# EAGLE design Raspberry_output_for_DC_slave_multi (EAGLE 5.10)
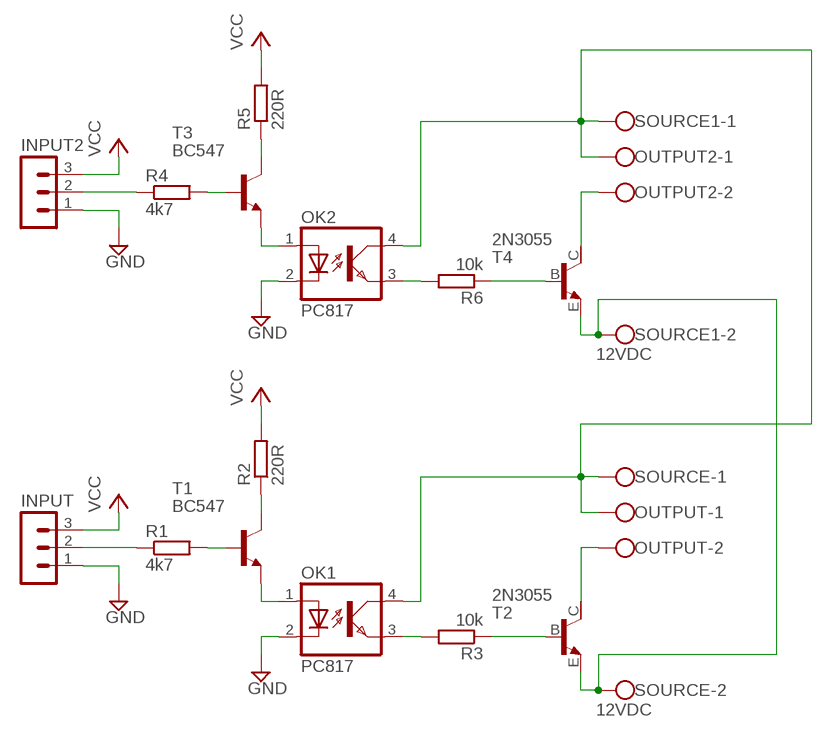
[diagram p0: schematic, sheet 1]

## Parts
INPUT  MA03-1  [MA03-1]
INPUT2  MA03-1  [MA03-1]
OK1  PC817  [DIL04]
OK2  PC817  [DIL04]
OUTPUT  W237-102  [W237-102]
OUTPUT2  W237-102  [W237-102]
R1  4k7  R-EU_0207/10  [0207/10]
R2  220R  R-EU_0207/10  [0207/10]
R3  10k  R-EU_0207/10  [0207/10]
R4  4k7  R-EU_0207/10  [0207/10]
R5  220R  R-EU_0207/10  [0207/10]
R6  10k  R-EU_0207/10  [0207/10]
SOURCE  12VDC  W237-102  [W237-102]
SOURCE1  12VDC  W237-102  [W237-102]
T1  BC547  [TO92]
T2  2N3055  [TO3]
T3  BC547  [TO92]
T4  2N3055  [TO3]

## Nets
GND: INPUT2.1 INPUT.1 OK1.2(C) OK2.2(C)
INPUT: INPUT.2 R1.1
INPUT1: INPUT2.2 R4.1
INPUT_REGULATED_CURR_2_BASE: R1.2 T1.2(B)
INPUT_REGULATED_CURR_2_BASE1: R4.2 T3.2(B)
N$1: R5.1 T3.3(C)
N$2: R2.1 T1.3(C)
OPTO_IN: OK1.1(A) T1.1(E)
OPTO_IN1: OK2.1(A) T3.1(E)
OPTO_OUT_2_TR: OK1.3(EMIT) R3.2
OPTO_OUT_2_TR1: OK2.3(EMIT) R6.2
OUTPUT_N: OUTPUT.2 T2.C
OUTPUT_N1: OUTPUT2.2 T4.C
SOURCE_N_0V: SOURCE1.2 SOURCE.2 T2.E T4.E
SOURCE_P_12V: OK1.4(COL) OK2.4(COL) OUTPUT2.1 OUTPUT.1 SOURCE1.1 SOURCE.1
TR_OUTPUT_BASE: R3.1 T2.B
TR_OUTPUT_BASE1: R6.1 T4.B
VCC: INPUT2.3 INPUT.3 R2.2 R5.2
Unconnected: T2.C/(C) T4.C/(C)

## Library data of the parts
INPUT INPUT2 = con-lstb:MA03-1: PIN HEADER
OK1 OK2 = optocoupler:PC817: SHARP OPTO COUPLER
OUTPUT OUTPUT2 SOURCE SOURCE1 = con-wago-500:W237-102: WAGO SCREW CLAMP
R1-R6 = rcl:R-EU_: RESISTOR, European symbol
T1 T3 = transistor-neu-to92:BC547: NPN TRANSISTOR
T2 T4 = transistor:2N3055: NPN TRANSISTOR

## Board
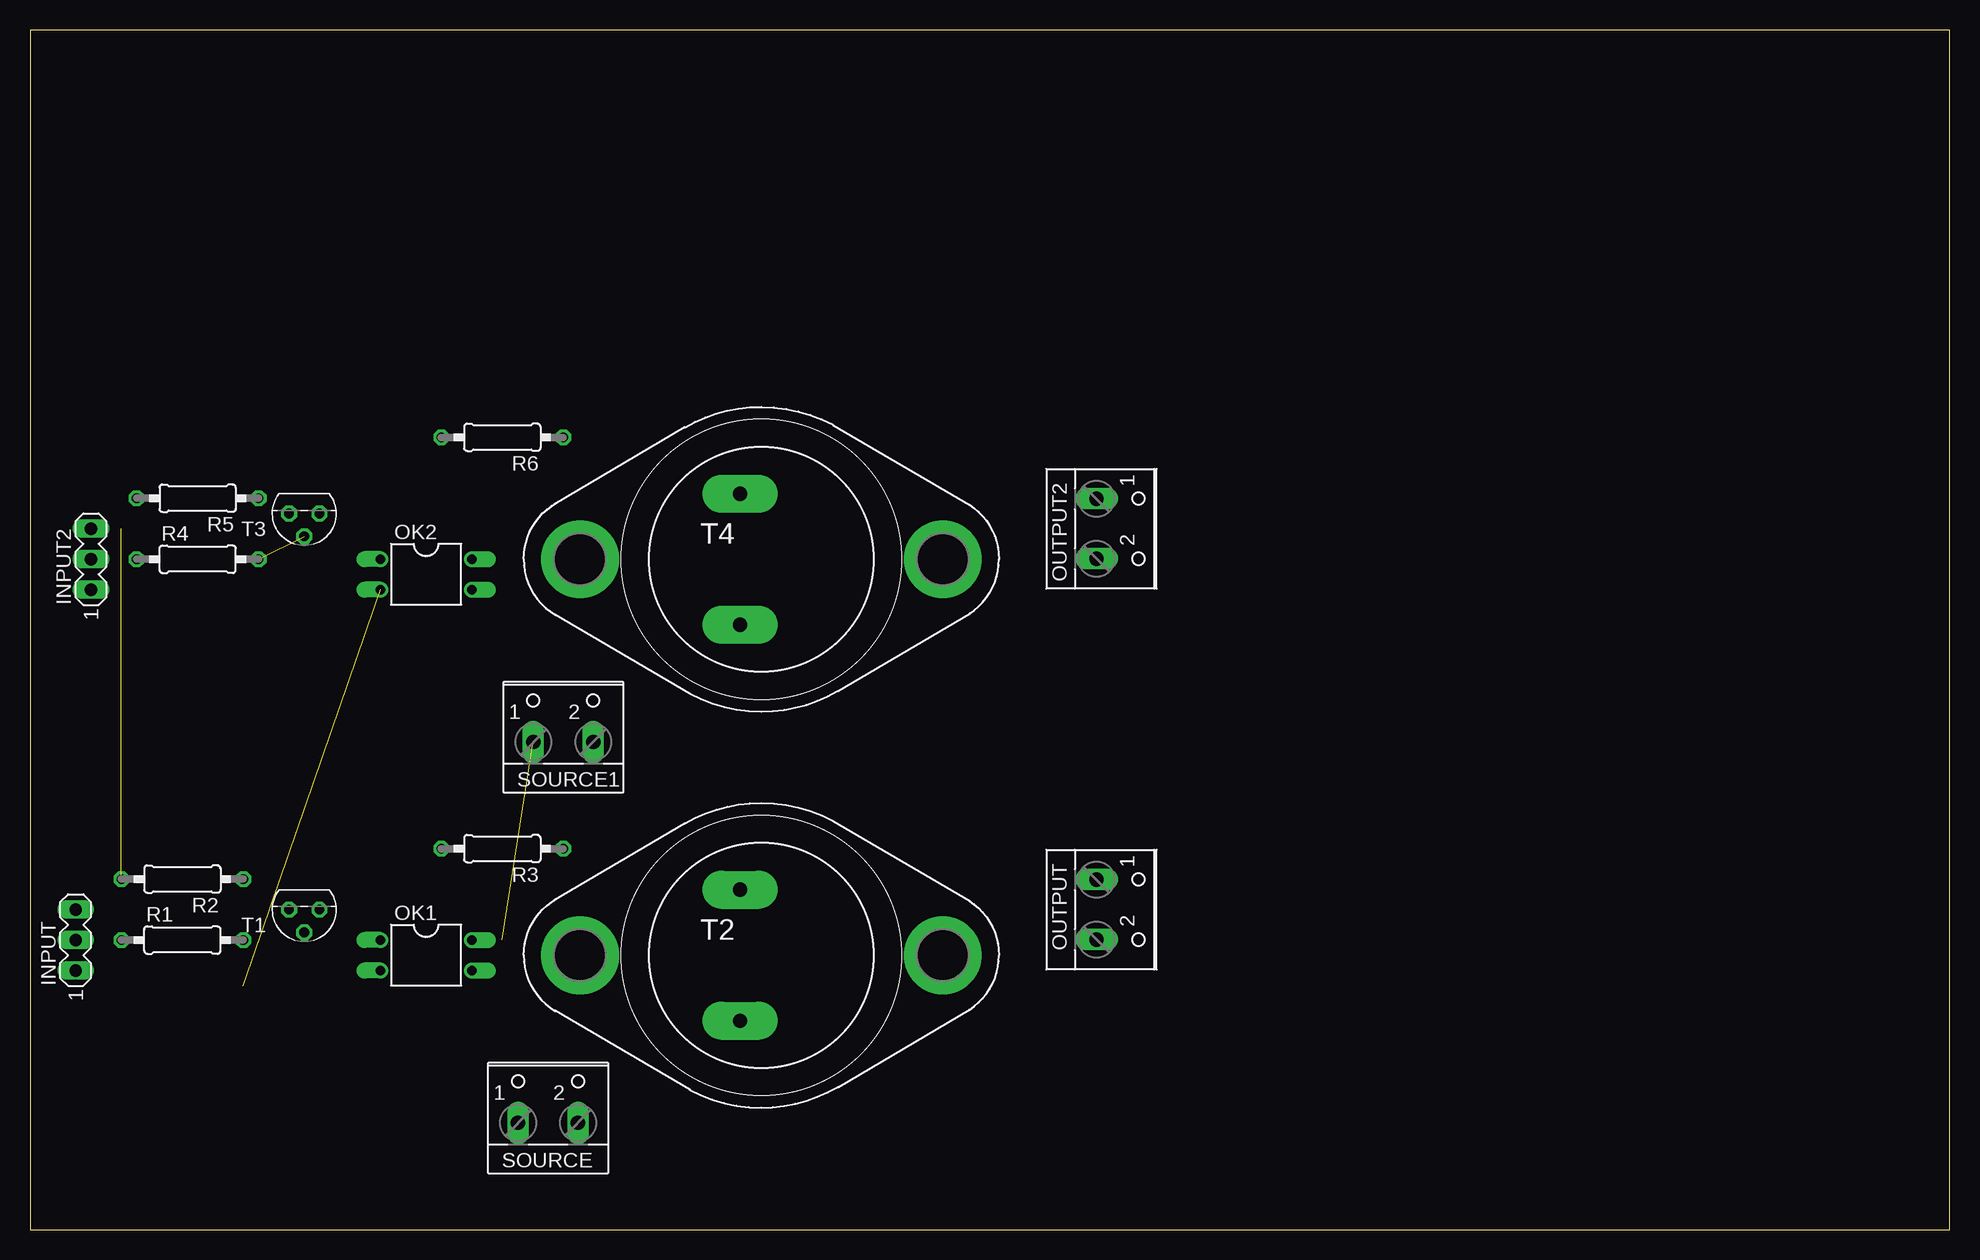
[diagram p1: board, top side]
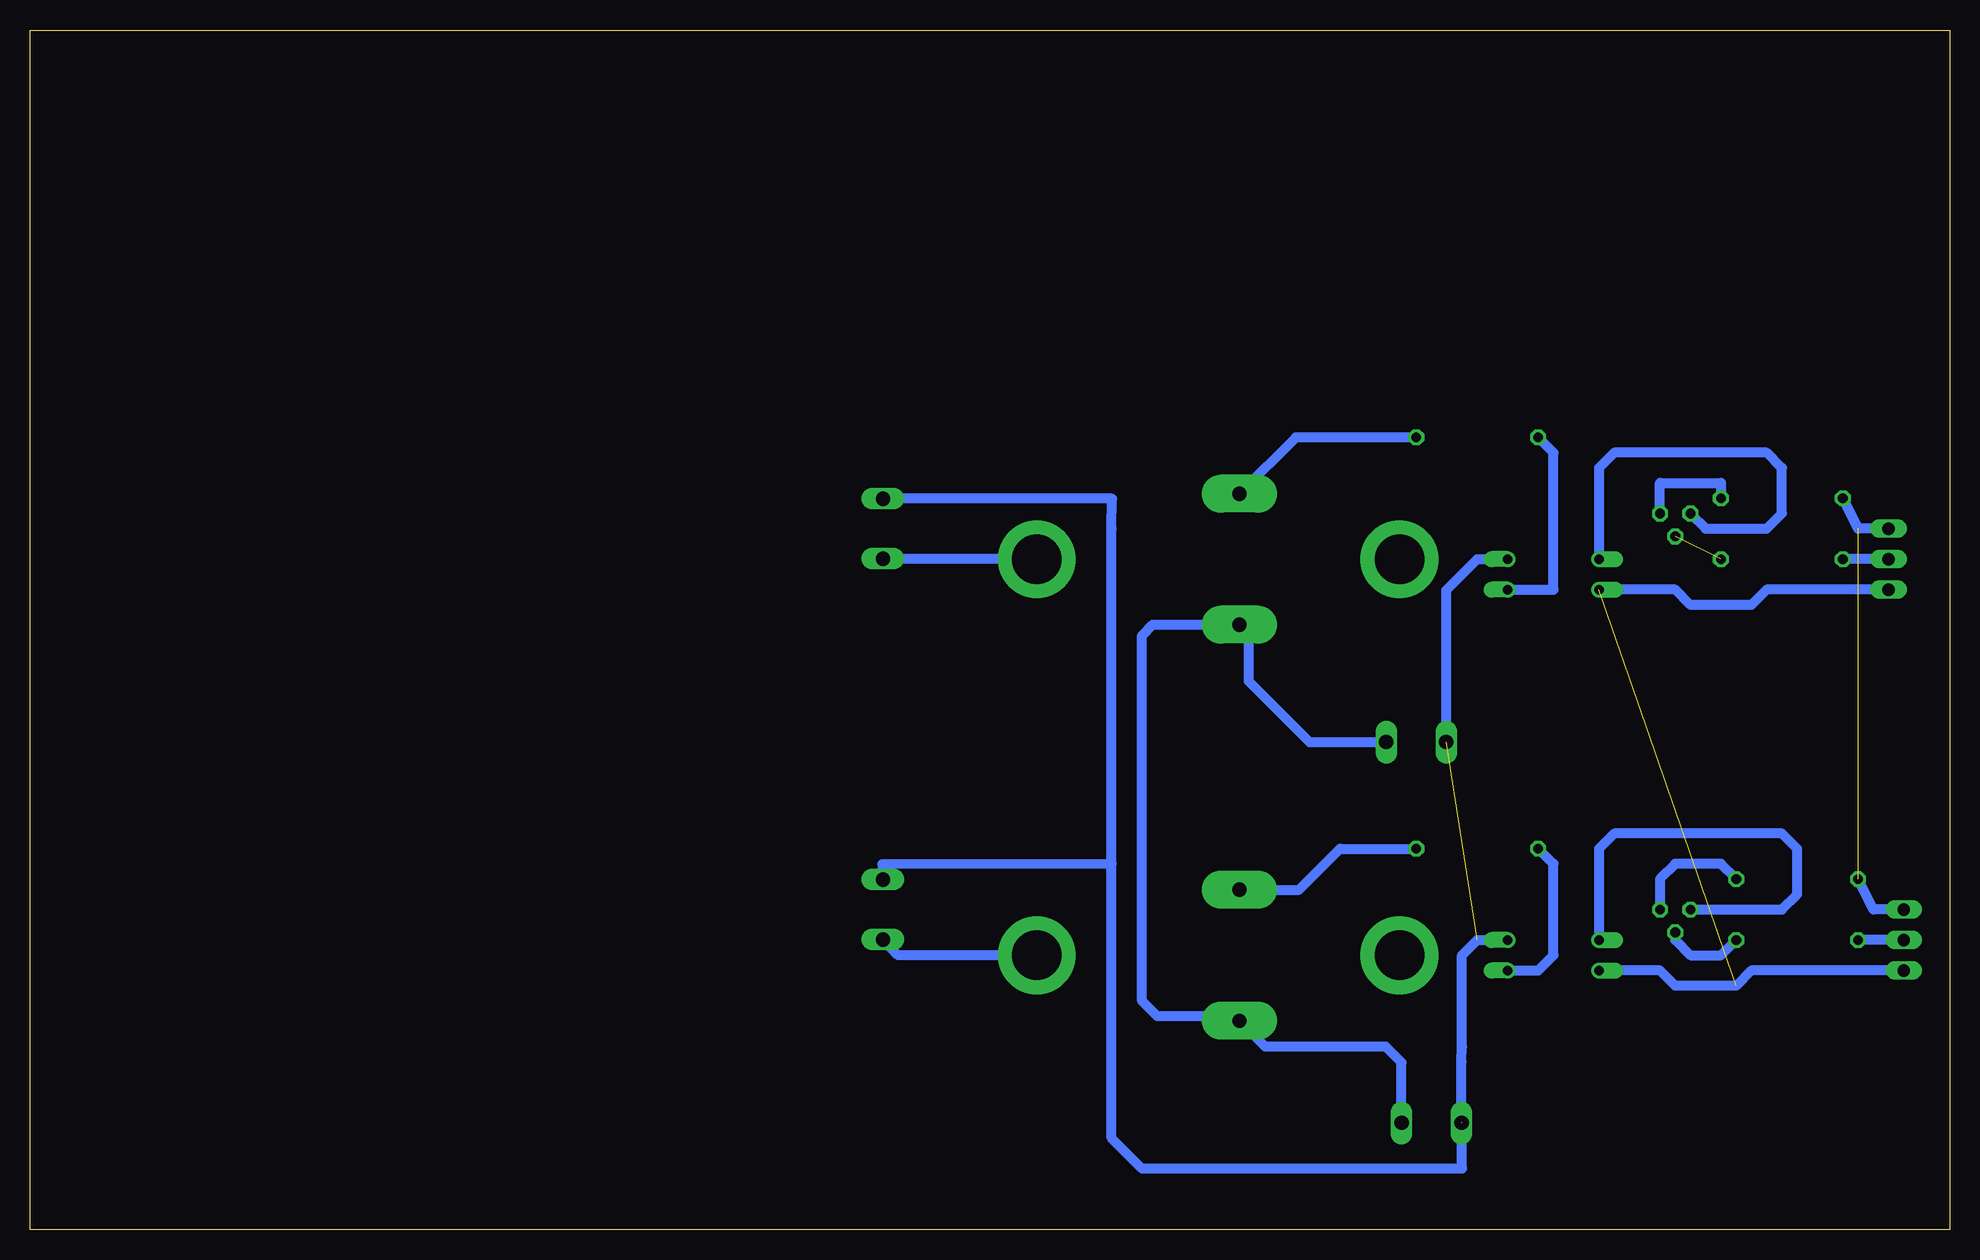
[diagram p2: board, bottom side, seen from below]

Size 160 x 100 mm. Coordinates in mm from the lower left corner, seen from the top.
Outline: 0,0 160,0 160,100 0,100 0,0
Copper layers (1*16): Top 0.035mm / dielectric 1.5mm / Bottom 0.035mm
Design rules "default": minimum track width 10mil, minimum drill 24mil, track to track 8mil, track to pad 8mil, pad to pad 8mil, via to via 8mil, smd to smd 8mil, copper to edge 40mil, drill to drill 8mil, minimum pad ring 10mil, minimum via ring 8mil, stop-mask expansion 4mil, vias tented up to drill 0mil, thermal gap 10mil

### Footprints (pad centres in the part's own frame; a part is rotated, then mirrored left to right if it is on the bottom)
MA03-1 = drill 1.016 long: 1 -2.54,0; 2 0,0; 3 2.54,0
DIL04 = drill 0.813 offset: 1 -1.27,-3.81; 2 1.27,-3.81; 3 1.27,3.81; 4 -1.27,3.81
W237-102 = drill 1.194 long: 1 -2.5,-1.27; 2 2.5,-1.27
0207/10 = drill 0.813 octagon: 1 -5.08,0; 2 5.08,0
TO92 = drill 0.813 octagon: 1 1.27,0; 2 0,1.905; 3 -1.27,0
TO3 = drill 1.194 pad 3.15 long: B -1.778,5.461; E -1.778,-5.461 | drill 4.115 pad 6.477 round: C 15.113,0; C/ -15.113,0

### Placement (x,y rotation side)
INPUT  3.81,24.13 90 top
INPUT2  5.08,55.88 90 top
OK1  33.02,22.86 270 top
OK2  33.02,54.61 270 top
OUTPUT  90.17,26.67 270 top
OUTPUT2  90.17,58.42 270 top
R1  12.7,24.13 0 top
R2  12.7,29.21 180 top
R3  39.37,31.75 180 top
R4  13.97,55.88 0 top
R5  13.97,60.96 180 top
R6  39.37,66.04 180 top
SOURCE  43.18,10.16 0 top
SOURCE1  44.45,41.91 0 top
T1  22.86,26.67 180 top
T2  60.96,22.86 0 top
T3  22.86,59.69 180 top
T4  60.96,55.88 0 top

### Tracks (layer width: path | path; a pad name or v marks a point on that pad's centre or on a via)
GND  (1 unrouted)
  Bottom 0.813: INPUT.1 16.51,21.59 17.78,20.32 22.86,20.32 24.13,21.59 OK1.2 | INPUT2.1 15.24,53.34 16.51,52.07 21.59,52.07 22.86,53.34 OK2.2
INPUT
  Bottom 0.813: INPUT.2 R1.1
INPUT1
  Bottom 0.813: INPUT2.2 R4.1
INPUT_REGULATED_CURR_2_BASE
  Bottom 0.813: T1.2 22.86,24.13 21.59,22.86 19.05,22.86 R1.2
INPUT_REGULATED_CURR_2_BASE1  (1 unrouted)
N$1
  Bottom 0.813: T3.3 24.13,62.23 19.05,62.23 R5.1
N$2
  Bottom 0.813: R2.1 19.05,30.48 22.86,30.48 24.13,29.21 T1.3
OPTO_IN
  Bottom 0.813: T1.1 13.97,26.67 12.7,27.94 12.7,31.75 13.97,33.02 27.94,33.02 29.21,31.75 OK1.1
OPTO_IN1
  Bottom 0.813: T3.1 20.32,58.42 15.24,58.42 13.97,59.69 13.97,63.5 15.24,64.77 27.94,64.77 29.21,63.5 OK2.1
OPTO_OUT_2_TR
  Bottom 0.813: OK1.3 34.29,21.59 33.02,22.86 33.02,30.48 R3.2
OPTO_OUT_2_TR1
  Bottom 0.813: OK2.3 33.02,53.34 33.02,64.77 R6.2
OUTPUT_N
  Bottom 0.813: T2.C 87.63,22.86 OUTPUT.2
OUTPUT_N1
  Bottom 0.813: OUTPUT2.2 76.11,55.92 T4.C
SOURCE_N_0V
  Bottom 0.813: SOURCE.2 45.68,13.93 46.99,15.24 57.02,15.24 T2.E 59.56,17.78 66.04,17.78 67.31,19.05 67.31,49.53 66.42,50.42 T4.E 58.42,49.66 58.42,45.72 53.34,40.64 SOURCE1.2
SOURCE_P_12V  (2 unrouted)
  Bottom 0.813: SOURCE.1 40.68,14.01 40.64,15.24 40.64,22.86 39.37,24.13 OK1.4 | OUTPUT.1 88.94,30.44 69.85,30.48 | 69.85,30.48 69.85,7.62 67.31,5.08 40.64,5.08 40.64,8.89 | OUTPUT2.1 69.81,60.92 69.85,58.42 69.85,30.48 | SOURCE1.1 41.95,53.3 39.37,55.88 OK2.4
TR_OUTPUT_BASE
  Bottom 0.813: T2.B 54.23,28.32 50.8,31.75 R3.1
TR_OUTPUT_BASE1
  Bottom 0.813: R6.1 54.48,66.04 T4.B
VCC  (1 unrouted)
  Bottom 0.813: INPUT.3 6.35,26.67 R2.2 | INPUT2.3 7.62,58.42 R5.2